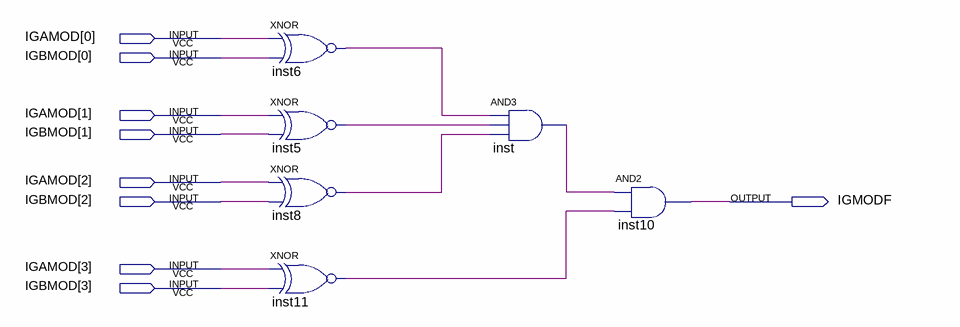
[diagram p0: schematic sheet]
// Quartus schematic IgualdadeMODULO.bdf as structural Verilog: 6 symbols, 9 pins
module IgualdadeMODULO (
  input  [3:0] IGAMOD,
  input  [3:0] IGBMOD,
  output IGMODF
);

  wire inst5_out, inst6_out, inst8_out, inst11_out, inst_out;

  xnor inst6 (inst6_out, IGAMOD[0], IGBMOD[0]);
  xnor inst5 (inst5_out, IGAMOD[1], IGBMOD[1]);
  xnor inst8 (inst8_out, IGAMOD[2], IGBMOD[2]);
  xnor inst11 (inst11_out, IGAMOD[3], IGBMOD[3]);
  and inst (inst_out, inst6_out, inst5_out, inst8_out);
  and inst10 (IGMODF, inst_out, inst11_out);
endmodule
